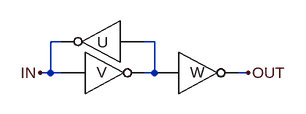
[diagram p0: schematic Latch.asc]
Latch.asc, the LTspice schematic file:
Version 4
SHEET 1 3196 896
WIRE 208 480 192 480
WIRE 352 480 336 480
WIRE 192 528 192 480
WIRE 192 528 176 528
WIRE 208 528 192 528
WIRE 352 528 352 480
WIRE 352 528 336 528
WIRE 496 528 480 528
FLAG 176 528 IN
FLAG 496 528 OUT
SYMBOL inverter 272 480 M0
WINDOW 3 0 0 Invisible 2
WINDOW 0 -9 1 Left 2
SYMATTR InstName U
SYMATTR SpiceLine W={U}
SYMBOL inverter 272 528 M180
WINDOW 3 0 0 Invisible 2
WINDOW 0 -9 1 Left 2
SYMATTR InstName V
SYMATTR SpiceLine W={V}
SYMBOL inverter 416 528 M180
WINDOW 3 0 0 Invisible 2
WINDOW 0 -9 1 Left 2
SYMATTR InstName W
SYMATTR SpiceLine W={W}

The netlist it stands for:
* Latch.asc
XU N001 IN inverter W={U}  ; pins IN OUT
XV IN N001 inverter W={V}  ; pins IN OUT
XW N001 OUT inverter W={W}  ; pins IN OUT
.backanno
.end